# EAGLE design Assistividade (EAGLE 6.3)
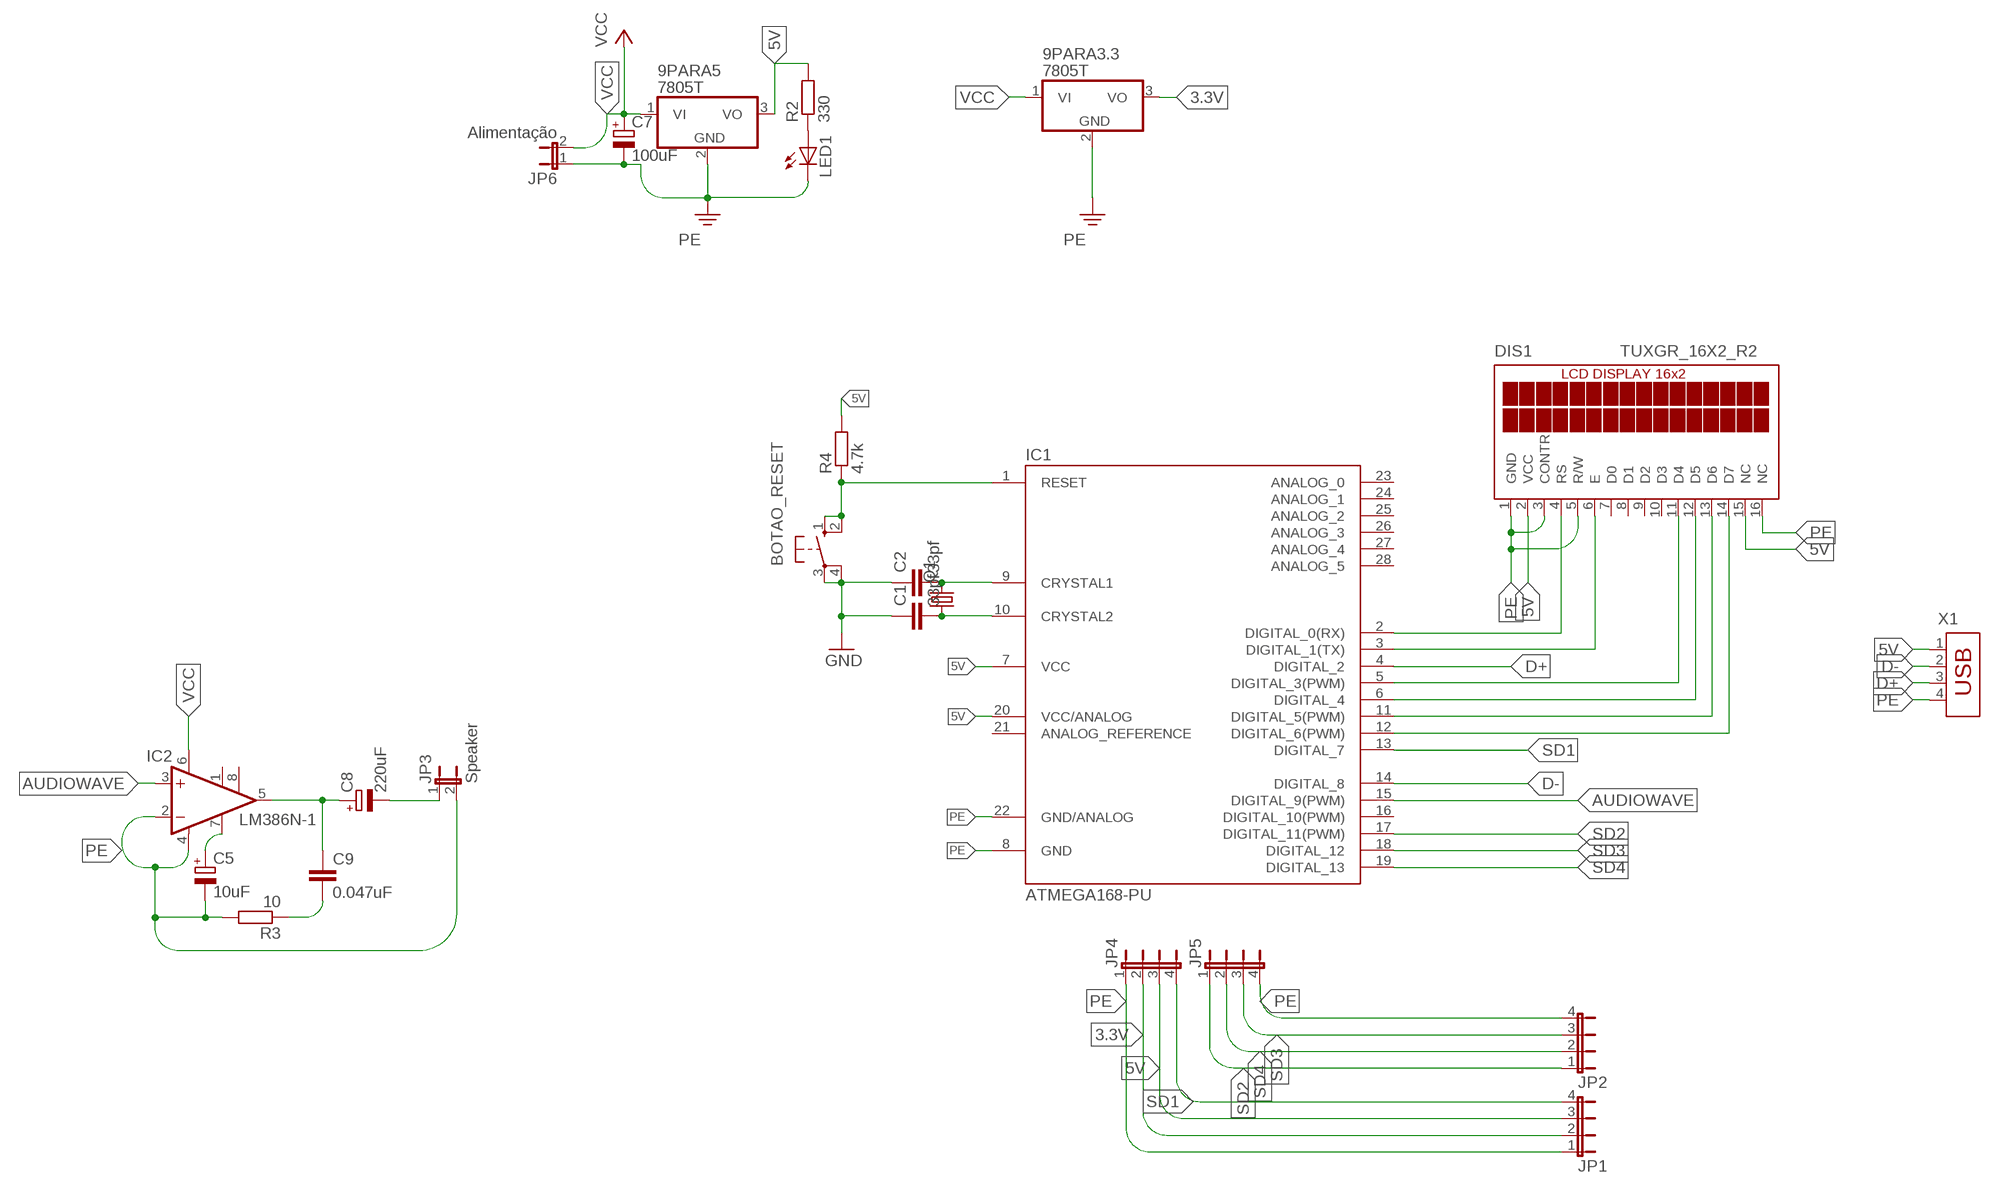
[diagram p0: schematic, sheet 1]

## Parts
9PARA3.3  7805T  [TO220H]
9PARA5  7805T  [TO220H]
BOTAO_RESET  10-XX  [B3F-10XX]
C1  33pf  C-EU025-024X044  [C025-024X044]
C2  33pf  C-EU025-024X044  [C025-024X044]
C5  10uF  CPOL-EUE2.5-5  [E2,5-5]
C7  100uF  CPOL-EUE2.5-6  [E2,5-6]
C8  220uF  CPOL-EUE2.5-7  [E2,5-7]
C9  0.047uF  C-EU050-025X075  [C050-025X075]
DIS1  TUXGR_16X2_R2  [TUXGR_16X2_R2]
IC1  ATMEGA168-PU  [DIL28-3]
IC2  LM386N-1  [DIL08]
JP1  JP4E  [JP4]
JP2  JP4E  [JP4]
JP3  Speaker  JP1E  [JP1]
JP4  JP4E  [JP4]
JP5  JP4E  [JP4]
JP6  Alimentação  JP1E  [JP1]
LED1  LED5MM  [LED5MM]
Q1  CRYSTALHC49U-V  [HC49U-V]
R2  330  R-EU_0207/10  [0207/10]
R3  10  R-EU_0207/10  [0207/10]
R4  4.7k  R-EU_0207/15  [0207/15]
X1  USB-787616  [USB]

## Nets
3.3V: 9PARA3.3.3(VO) JP1.2 JP4.2
5V: 9PARA5.3(VO) DIS1.2(VCC) DIS1.15(NC) IC1.7(VCC) IC1.20(VCC/ANALOG) JP1.3 JP4.3 R2.2 R4.2 X1.1
AUDIOWAVE: IC1.15(DIGITAL_9(PWM)) IC2.3(+IN)
D+: IC1.4(DIGITAL_2) X1.3
D-: IC1.14(DIGITAL_8) X1.2
N$1: C1.2 IC1.10(CRYSTAL2) Q1.1
N$2: C2.2 IC1.9(CRYSTAL1) Q1.2
N$3: BOTAO_RESET.1(S) BOTAO_RESET.2(S1) IC1.1(RESET) R4.1
N$4: C5.+ IC2.7(BYPASS)
N$6: LED1.A R2.1
N$9: DIS1.12(D5) IC1.6(DIGITAL_4)
N$10: DIS1.13(D6) IC1.11(DIGITAL_5(PWM))
N$11: DIS1.14(D7) IC1.12(DIGITAL_6(PWM))
N$14: DIS1.4(RS) IC1.2(DIGITAL_0(RX))
N$15: DIS1.6(E) IC1.3(DIGITAL_1(TX))
N$16: DIS1.11(D4) IC1.5(DIGITAL_3(PWM))
N$20: C9.2 R3.1
N$21: C8.+ C9.1 IC2.5(OUT)
N$22: C8.- JP3.1
PE: 9PARA3.3.2(GND) 9PARA5.2(GND) BOTAO_RESET.3(P) BOTAO_RESET.4(P1) C1.1 C2.1 C5.- C7.- DIS1.1(GND) DIS1.3(CONTR) DIS1.5(R/W) DIS1.16(NC) IC1.8(GND) IC1.22(GND/ANALOG) IC2.2(-IN) IC2.4(GND) JP1.1 JP2.4 JP3.2 JP4.1 JP5.4 JP6.1 LED1.K(C) R3.2 X1.4 ; supply symbol labelled GND
SD1: IC1.13(DIGITAL_7) JP1.4 JP4.4
SD2: IC1.17(DIGITAL_11(PWM)) JP2.1 JP5.1
SD3: IC1.18(DIGITAL_12) JP2.3 JP5.3
SD4: IC1.19(DIGITAL_13) JP2.2 JP5.2
VCC: 9PARA3.3.1(VI) 9PARA5.1(VI) C7.+ IC2.6(VS) JP6.2
Unconnected: DIS1.7(D0) DIS1.8(D1) DIS1.9(D2) DIS1.10(D3) IC1.16(DIGITAL_10(PWM)) IC1.21(ANALOG_REFERENCE) IC1.23(ANALOG_0) IC1.24(ANALOG_1) IC1.25(ANALOG_2) IC1.26(ANALOG_3) IC1.27(ANALOG_4) IC1.28(ANALOG_5) IC2.1(GAIN) IC2.8(GAIN)

## Library data of the parts
9PARA3.3 9PARA5 = linear:78*: Positive VOLTAGE REGULATOR Source: http://cache.national.com/ds/LM/LM78L05.pdf http://www.fairchildsemi.com/ds/LM/LM7805.pdf
BOTAO_RESET = switch-omron:10-XX: OMRON SWITCH; MPN: B3F-1000; OC_FARNELL: 176432; OC_NEWARK: 36M3542
C1 C2 C9 = rcl:C-EU: CAPACITOR, European symbol
C5 C7 C8 = rcl:CPOL-EU: POLARIZED CAPACITOR, European symbol
DIS1 = display-lcd:TUXGR_16X2_R2: Tuxgraphics LCD display 16x2 characters reflective, without background light Source: tuxgr_12x2_r2.pdf; OC_FARNELL: unknown; OC_NEWARK: unknown
IC1 = Arduino-AVR:ATMEGA168-PU
IC2 = linear:LM386?-*: Low Voltage Audio Power Amplifier Source: http://cache.national.com/ds/LM/LM386.pdf
JP1 JP2 JP4 JP5 = jumper:JP4E: JUMPER
JP3 JP6 = jumper:JP1E: JUMPER
LED1 = led:LED: LED OSRAM: - CHIPLED LG R971, LG N971, LY N971, LG Q971, LY Q971, LO R971, LY R971 LH N974, LH R974 LS Q976, LO Q976, LY Q976 LO Q996 - Hyper CHIPLED LW Q18S LB Q993, LB Q99A, LB R99A - SideLED LS A670, LO A670, LY A670, LG A670, LP A670 LB A673, LV A673, LT A673, LW A673 LH A674 LY A675 LS A676, LA A676, LO A676, LY A676, LW A676 LS A679, LY A679, LG A679 - Hyper Micro SIDELED® LS Y876, LA Y876, LO Y876, LY Y876 LT Y87S - SmartLED LW L88C, LW L88S LB L89C, LB L89S, LG L890 LS L89K, LO L89K, LY L89K LS L896, LA L896, LO L896, LY L896 - TOPLED LS T670, LO T670, LY T670, LG T670, LP T670 LSG T670, LSP T670, LSY T670, LOP T670, LYG T670 LG T671, LOG T671, LSG T671 LB T673, LV T673, LT T673, LW T673 LH T674 LS T676, LA T676, LO T676, LY T676, LB T676, LH T676, LSB T676, LW T676 LB T67C, LV T67C, LT T67C, LS T67K, LO T67K, LY T67K, LW E67C LS E67B, LA E67B, LO E67B, LY E67B, LB E67C, LV E67C, LT E67C LW T67C LS T679, LY T679, LG T679 LS T770, LO T770, LY T770, LG T770, LP T770 LB T773, LV T773, LT T773, LW T773 LH T774 LS E675, LA E675, LY E675, LS T675 LS T776, LA T776, LO T776, LY T776, LB T776 LHGB T686 LT T68C, LB T68C - Hyper Mini TOPLED® LB M676 - Mini TOPLED Santana® LG M470 LS M47K, LO M47K, LY M47K Source: http://www.osram.convergy.de LUXEON: - LUMILED® LXK2-PW12-R00, LXK2-PW12-S00, LXK2-PW14-U00, LXK2-PW14-V00 LXK2-PM12-R00, LXK2-PM12-S00, LXK2-PM14-U00 LXK2-PE12-Q00, LXK2-PE12-R00, LXK2-PE12-S00, LXK2-PE14-T00, LXK2-PE14-U00 LXK2-PB12-K00, LXK2-PB12-L00, LXK2-PB12-M00, LXK2-PB14-N00, LXK2-PB14-P00, LXK2-PB14-Q00 LXK2-PR12-L00, LXK2-PR12-M00, LXK2-PR14-Q00, LXK2-PR14-R00 LXK2-PD12-Q00, LXK2-PD12-R00, LXK2-PD12-S00 LXK2-PH12-R00, LXK2-PH12-S00 LXK2-PL12-P00, LXK2-PL12-Q00, LXK2-PL12-R00 Source: www.luxeon.com KINGBRIGHT: KA-3528ASYC Source: www.kingbright.com
Q1 = crystal:CRYSTAL: CRYSTAL; OC_FARNELL: 1666969; OC_NEWARK: unknown
R2 R3 = resistor:R-EU_: RESISTOR, European symbol
R4 = rcl:R-EU_: RESISTOR, European symbol
X1 = con-amp:USB-787616: AMP connector

## Board
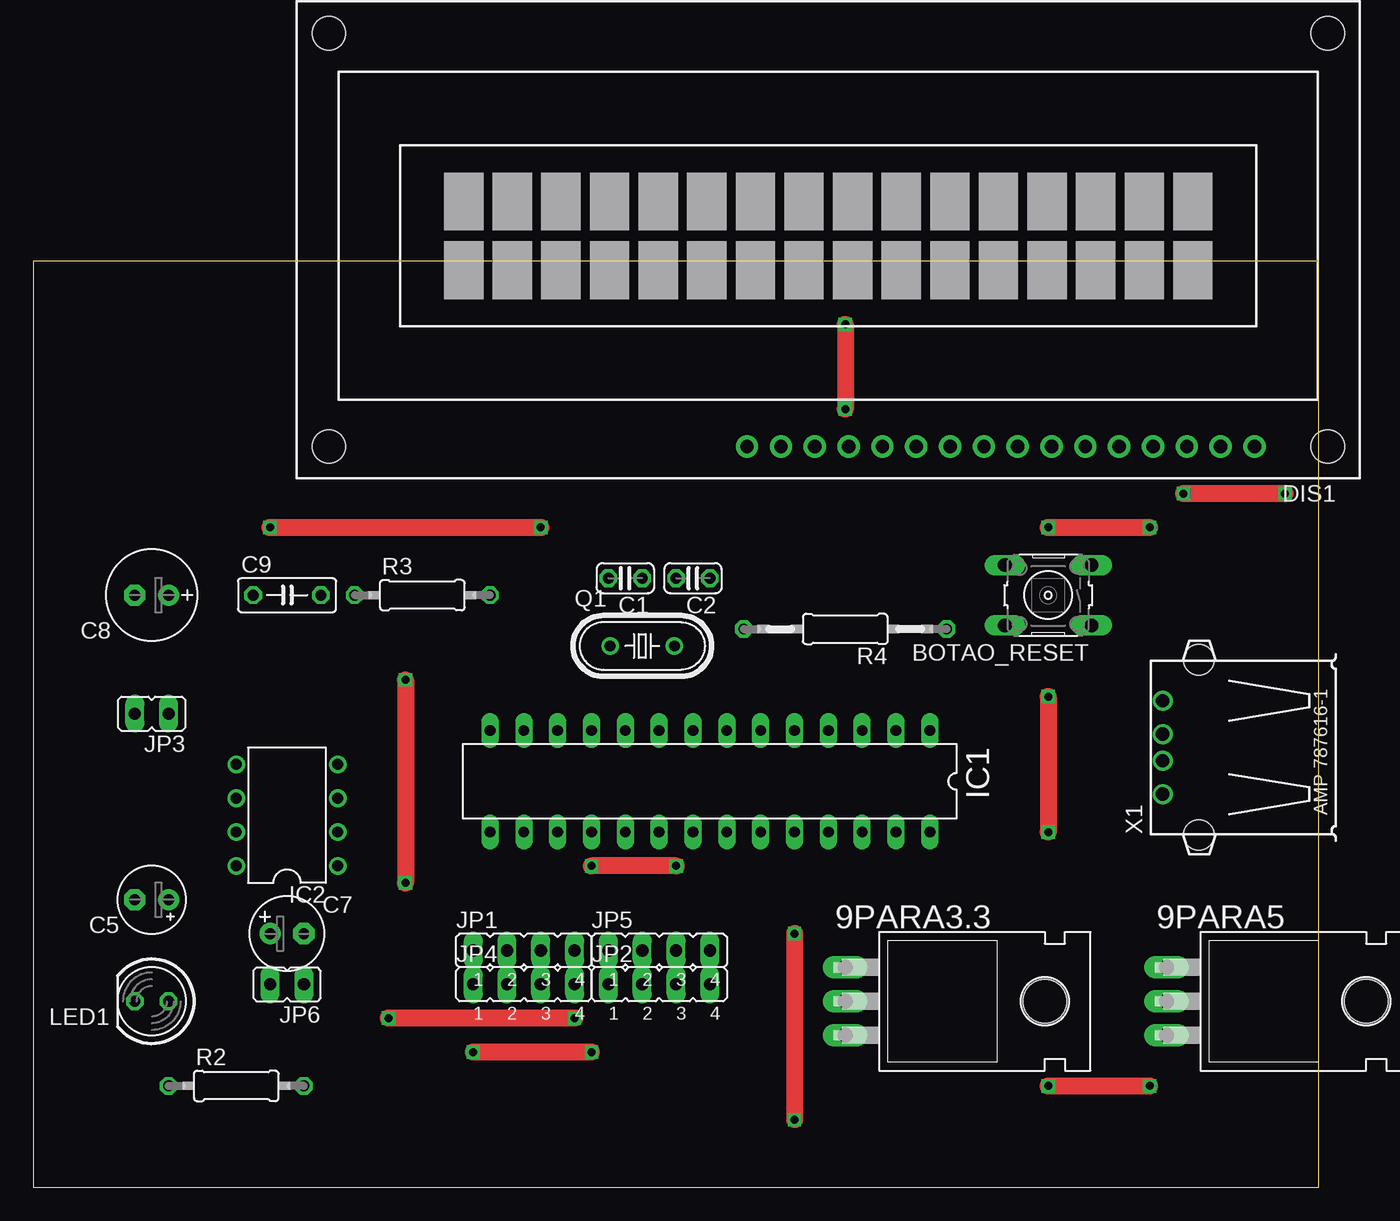
[diagram p1: board, top side]
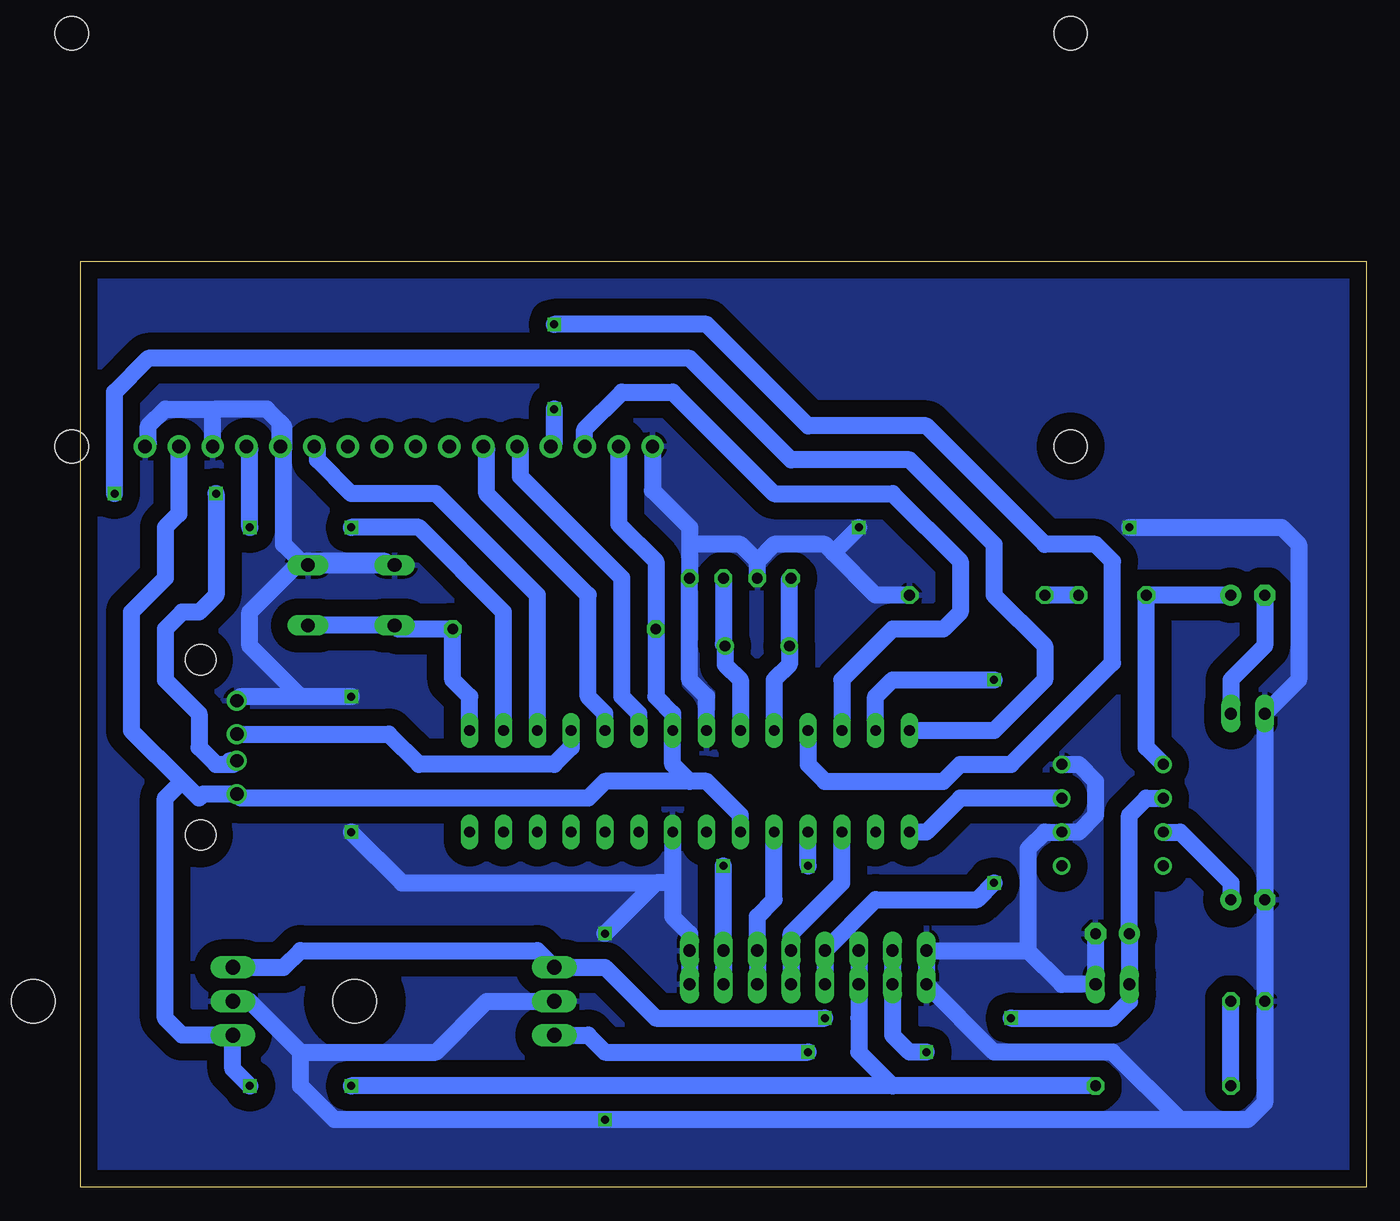
[diagram p2: board, bottom side, seen from below]

Size 96.5 x 69.52 mm. Coordinates in mm from the lower left corner, seen from the top.
Outline: 0,0 96.5,0 96.5,69.52 0,69.52 0,0
Copper layers (1*16): Top 0.035mm / dielectric 1.5mm / Bottom 0.035mm
Design rules "default": minimum track width 10mil, minimum drill 24mil, track to track 8mil, track to pad 8mil, pad to pad 8mil, via to via 8mil, smd to smd 8mil, copper to edge 40mil, drill to drill 8mil, minimum pad ring 10mil, minimum via ring 8mil, stop-mask expansion 4mil, vias tented up to drill 0mil, thermal gap 10mil

### Footprints (pad centres in the part's own frame; a part is rotated, then mirrored left to right if it is on the bottom)
TO220H = drill 1.118 long: 1 -2.54,-10.16; 2 0,-10.16; 3 2.54,-10.16 | hole 3.302: 0,4.826
B3F-10XX = drill 1.016 long: 1 -3.251,2.261; 2 3.251,2.261; 3 -3.251,-2.261; 4 3.251,-2.261
C025-024X044 = drill 0.813 octagon: 1 -1.27,0; 2 1.27,0
E2,5-5 = drill 0.813 pad 1.6: + -1.27,0 | drill 0.813 pad 1.6 octagon: - 1.27,0
E2,5-6 = drill 0.813 pad 1.6: + -1.27,0 | drill 0.813 pad 1.6 octagon: - 1.27,0
E2,5-7 = drill 0.813 pad 1.6: + -1.27,0 | drill 0.813 pad 1.6 octagon: - 1.27,0
C050-025X075 = drill 0.813 octagon: 1 -2.54,0; 2 2.54,0
TUXGR_16X2_R2 = drill 1 pad 1.676: 1 -32,15.5; 2 -29.46,15.5; 3 -26.92,15.5; 4 -24.38,15.5; 5 -21.84,15.5; 6 -19.3,15.5; 7 -16.76,15.5; 8 -14.22,15.5; 9 -11.68,15.5; 10 -9.14,15.5; 11 -6.6,15.5; 12 -4.06,15.5; 13 -1.52,15.5; 14 1.02,15.5; 15 3.56,15.5; 16 6.1,15.5 | hole 2.5: -37.5,-15.5; 37.5,-15.5; -37.5,15.5; 37.5,15.5
DIL28-3 = drill 0.813 long: 1 -16.51,-3.81; 2 -13.97,-3.81; 3 -11.43,-3.81; 4 -8.89,-3.81; 5 -6.35,-3.81; 6 -3.81,-3.81; 7 -1.27,-3.81; 8 1.27,-3.81; 9 3.81,-3.81; 10 6.35,-3.81; 11 8.89,-3.81; 12 11.43,-3.81; 13 13.97,-3.81; 14 16.51,-3.81; 15 16.51,3.81; 16 13.97,3.81; 17 11.43,3.81; 18 8.89,3.81; 19 6.35,3.81; 20 3.81,3.81; 21 1.27,3.81; 22 -1.27,3.81; 23 -3.81,3.81; 24 -6.35,3.81; 25 -8.89,3.81; 26 -11.43,3.81; 27 -13.97,3.81; 28 -16.51,3.81
DIL08 = drill 0.813 pad 1.27: 1 -3.81,-3.81; 2 -1.27,-3.81; 3 1.27,-3.81; 4 3.81,-3.81; 5 3.81,3.81; 6 1.27,3.81; 7 -1.27,3.81; 8 -3.81,3.81
JP4 = drill 0.914 long: 1 -3.81,0; 2 -1.27,0; 3 1.27,0; 4 3.81,0
JP1 = drill 0.914 long: 1 0,-1.27; 2 0,1.27
LED5MM = drill 0.813 octagon: A -1.27,0; K 1.27,0
HC49U-V = drill 0.813: 1 -2.413,0; 2 2.413,0
0207/10 = drill 0.813 octagon: 1 -5.08,0; 2 5.08,0
0207/15 = drill 0.813 octagon: 1 -7.62,0; 2 7.62,0
USB = drill 1: 1 -3.5,12.99; 2 -1,12.99; 3 1,12.99; 4 3.5,12.99 | hole 2.3: -6.57,10.28; 6.57,10.28

### Placement (x,y rotation side)
9PARA3.3  71.12,13.97 270 top
9PARA5  95.25,13.97 270 top
BOTAO_RESET  76.2,44.45 180 top
C1  44.45,45.72 180 top
C2  49.53,45.72 180 top
C5  8.89,21.59 180 top
C7  19.05,19.05 0 top
C8  8.89,44.45 180 top
C9  19.05,44.45 0 top
DIS1  59.69,71.12 180 top
IC1  50.8,30.48 180 top
IC2  19.05,27.94 90 top
JP1  36.83,17.78 0 top
JP2  46.99,15.24 0 top
JP3  8.89,35.56 90 top
JP4  36.83,15.24 0 top
JP5  46.99,17.78 0 top
JP6  19.05,15.24 90 top
LED1  8.89,13.97 180 top
Q1  45.72,40.64 0 top
R2  15.24,7.62 0 top
R3  29.21,44.45 0 top
R4  60.96,41.91 180 top
X1  97.79,33.02 90 top

### Tracks (layer width: path | path; a pad name or v marks a point on that pad's centre or on a via)
3.3V  (via drill 0.6)
  Top 1.27: v41.91,10.16 v33.02,10.16
  Bottom 1.27: JP1.2 JP4.2 35.56,11.43 34.29,10.16 v33.02,10.16 | 9PARA3.3.3 58.42,11.43 57.15,10.16 v41.91,10.16
5V  (via drill 0.6)
  Top 1.27: v76.2,7.62 v83.82,7.62
  Bottom 1.27: JP1.3 JP4.3 | DIS1.15 56.13,49.78 53.34,46.99 R4.2 53.34,36.83 52.07,35.56 IC1.7 52.07,31.75 50.8,30.48 | DIS1.2 89.15,50.55 90.17,49.53 90.17,45.72 92.71,43.18 92.71,34.29 88.9,30.48 | R2.2 35.56,7.62 | JP1.3 38.1,12.7 | IC1.20 46.99,27.94 49.53,30.48 50.8,30.48 | 50.8,30.48 57.15,30.48 58.42,29.21 84.49,29.21 X1.1 87.32,29.52 87.63,29.21 88.9,30.48 | JP1.3 38.1,10.16 35.56,7.62 | 35.56,7.62 v76.2,7.62 | v83.82,7.62 85.09,8.89 9PARA5.3 88.9,11.43 90.17,12.7 90.17,29.21 88.9,30.48
AUDIOWAVE
  Bottom 1.27: IC2.3 30.48,29.21 33.02,26.67 IC1.15
D+
  Bottom 1.27: IC1.4 59.69,33.02 60.96,31.75 71.12,31.75 73.39,34.02 X1.3
D-  (via drill 0.6)
  Top 1.27: v93.98,52.07 v86.36,52.07
  Bottom 1.27: v93.98,52.07 93.98,59.69 91.44,62.23 50.8,62.23 43.18,54.61 34.29,54.61 27.94,48.26 27.94,44.45 24.13,40.64 24.13,38.1 27.94,34.29 IC1.14 | 85.09,31.75 85.36,32.02 X1.2 85.07,31.75 85.09,31.75 | v86.36,52.07 86.36,44.45 87.63,43.18 88.9,43.18 90.17,41.91 90.17,38.1 87.63,35.56 87.63,33.02 86.36,31.75 85.09,31.75
N$1
  Bottom 1.27: C1.2 43.31,45.59 Q1.1 43.31,39.24 44.45,38.1 IC1.10
N$2
  Bottom 1.27: IC1.9 46.99,38.1 48.13,39.24 Q1.2 48.26,40.77 C2.2
N$3
  Bottom 1.27: BOTAO_RESET.1 BOTAO_RESET.2 72.67,41.91 R4.1 68.58,38.1 67.31,36.83 IC1.1
N$4
  Bottom 1.27: IC2.7 13.97,26.67 10.16,22.86 C5.+
N$6
  Bottom 1.27: R2.1 LED1.A
N$9
  Bottom 1.27: IC1.6 54.61,35.56 55.88,36.83 55.88,45.72 63.5,53.34 63.5,55.37 DIS1.12
N$10  (via drill 0.6)
  Top 1.27: v60.96,64.77 v60.96,58.42
  Bottom 1.27: IC1.11 41.91,31.75 40.64,30.48 31.75,30.48 30.48,31.75 26.67,31.75 19.05,39.37 19.05,46.99 20.32,48.26 24.13,48.26 33.02,57.15 41.91,57.15 49.53,64.77 v60.96,64.77 | v60.96,58.42 60.96,55.87 DIS1.13
N$11
  Bottom 1.27: DIS1.14 58.67,56.9 55.88,59.69 52.07,59.69 44.45,52.07 35.56,52.07 30.48,46.99 30.48,43.18 31.75,41.91 35.56,41.91 39.37,38.1 IC1.12
N$14  (via drill 0.6)
  Top 1.27: v76.2,49.53 v83.82,49.53
  Bottom 1.27: IC1.2 64.77,43.18 71.12,49.53 v76.2,49.53 | v83.82,49.53 83.82,55.37 DIS1.4
N$15
  Bottom 1.27: IC1.3 62.23,44.45 69.85,52.07 76.2,52.07 78.74,54.61 78.74,55.37 DIS1.6
N$16
  Bottom 1.27: IC1.5 57.15,35.56 58.42,36.83 58.42,44.45 66.04,52.07 66.04,55.37 DIS1.11
N$20
  Bottom 1.27: C9.2 R3.1
N$21
  Bottom 1.27: C8.+ C9.1 16.51,33.02 IC2.5
N$22
  Bottom 1.27: C8.- 7.62,40.64 10.16,38.1 JP3.1
PE  (via drill 0.6)
  Top 1.27: v17.78,49.53 v38.1,49.53 | v76.2,36.83 v76.2,26.67 | v57.15,19.05 v57.15,5.08
  Bottom 1.27: 80.01,10.16 83.82,13.97 9PARA5.2 | 80.01,10.16 69.85,10.16 66.04,13.97 9PARA3.3.2 | 13.97,5.08 v57.15,5.08 77.47,5.08 80.01,7.62 80.01,10.16 | IC2.4 21.59,31.75 20.32,30.48 20.32,27.94 21.59,26.67 IC2.2 24.13,26.67 25.4,25.4 25.4,17.78 | 25.4,17.78 22.86,15.24 JP6.1 C7.- | IC1.8 49.53,36.83 50.8,38.1 C2.1 50.8,48.26 | DIS1.16 53.59,52.32 50.8,49.53 50.8,48.26 | 40.01,47.62 36.83,44.45 R3.2 | 40.01,47.62 40.64,48.26 44.45,48.26 45.72,46.99 | C1.1 45.72,46.99 | 45.72,46.99 46.99,48.26 50.8,48.26 | v38.1,49.53 40.01,47.62 | 80.01,46.99 79.73,46.71 BOTAO_RESET.3 BOTAO_RESET.4 73.38,46.71 73.66,46.99 80.01,46.99 | 81.28,55.37 81.28,48.26 80.01,46.99 | 81.28,55.37 DIS1.5 81.53,57.4 | 86.36,58.42 82.55,58.42 81.53,57.4 | DIS1.1 91.44,55.87 91.44,57.15 90.17,58.42 86.36,58.42 | DIS1.3 86.61,58.17 86.36,58.42 | 81.53,57.4 81.28,57.15 81.28,55.37 | 52.07,22.86 52.07,20.32 50.8,19.05 JP5.4 JP2.4 | v17.78,49.53 6.35,49.53 5.08,48.26 5.08,38.1 JP3.2 C5.- LED1.K 7.62,6.35 8.89,5.08 13.97,5.08 | v76.2,26.67 72.39,22.86 53.34,22.86 | X1.4 84.49,36.83 v76.2,36.83 80.01,36.83 83.82,40.64 83.82,43.18 80.01,46.99 | 25.4,17.78 JP1.1 JP4.1 27.94,10.16 19.05,10.16 13.97,5.08 | IC1.22 52.07,22.86 | 52.07,22.86 53.34,22.86 | 53.34,22.86 v57.15,19.05
  pour Bottom (isolate 1.27): 0,0 0,69.85 96.52,69.85 96.52,0
SD1  (via drill 0.6)
  Top 1.27: v27.94,38.1 v27.94,22.86
  Bottom 1.27: JP4.4 JP1.4 36.83,21.59 29.21,21.59 v27.94,22.86 | IC1.13 36.83,36.83 35.56,38.1 v27.94,38.1
SD2
  Bottom 1.27: JP2.1 JP5.1 43.18,19.05 39.37,22.86 IC1.17
SD3  (via drill 0.6)
  Top 1.27: v48.26,24.13 v41.91,24.13
  Bottom 1.27: JP2.3 JP5.3 v48.26,24.13 | v41.91,24.13 IC1.18
SD4
  Bottom 1.27: JP2.2 JP5.2 45.72,20.32 44.45,21.59 IC1.19
VCC  (via drill 0.6)
  Top 1.27: v40.64,12.7 v26.67,12.7
  Bottom 1.27: 9PARA5.1 81.28,16.51 80.01,17.78 62.23,17.78 9PARA3.3.1 57.15,16.51 53.34,12.7 v40.64,12.7 | IC2.6 16.51,29.21 17.78,27.94 C7.+ JP6.2 17.78,13.97 19.05,12.7 v26.67,12.7